# Altium schematic sheet RMII_Ethernet.SchDoc: Thermostat 8CH
size 420 x 297 mm; Author: G.Kasprowicz; CompanyName: WUT ISE; DrawnBy: G.Kasprowicz; Organization: WUT ISE; Address1: PW ISE; Address2: Nowowiejska 15/19 00-665 Warsaw; Address3: gkasprow@gmail.com; DocumentNumber: 8; Revision: 1.0; SheetNumber: 8; SheetTotal: 9; ModifiedBy: -; CheckedDate: -; Title2: Ethernet; DivGrp: WUT ISE; Designer: G.Kasprowicz; ModifiedDate: -; ProjectName: Sensor Box
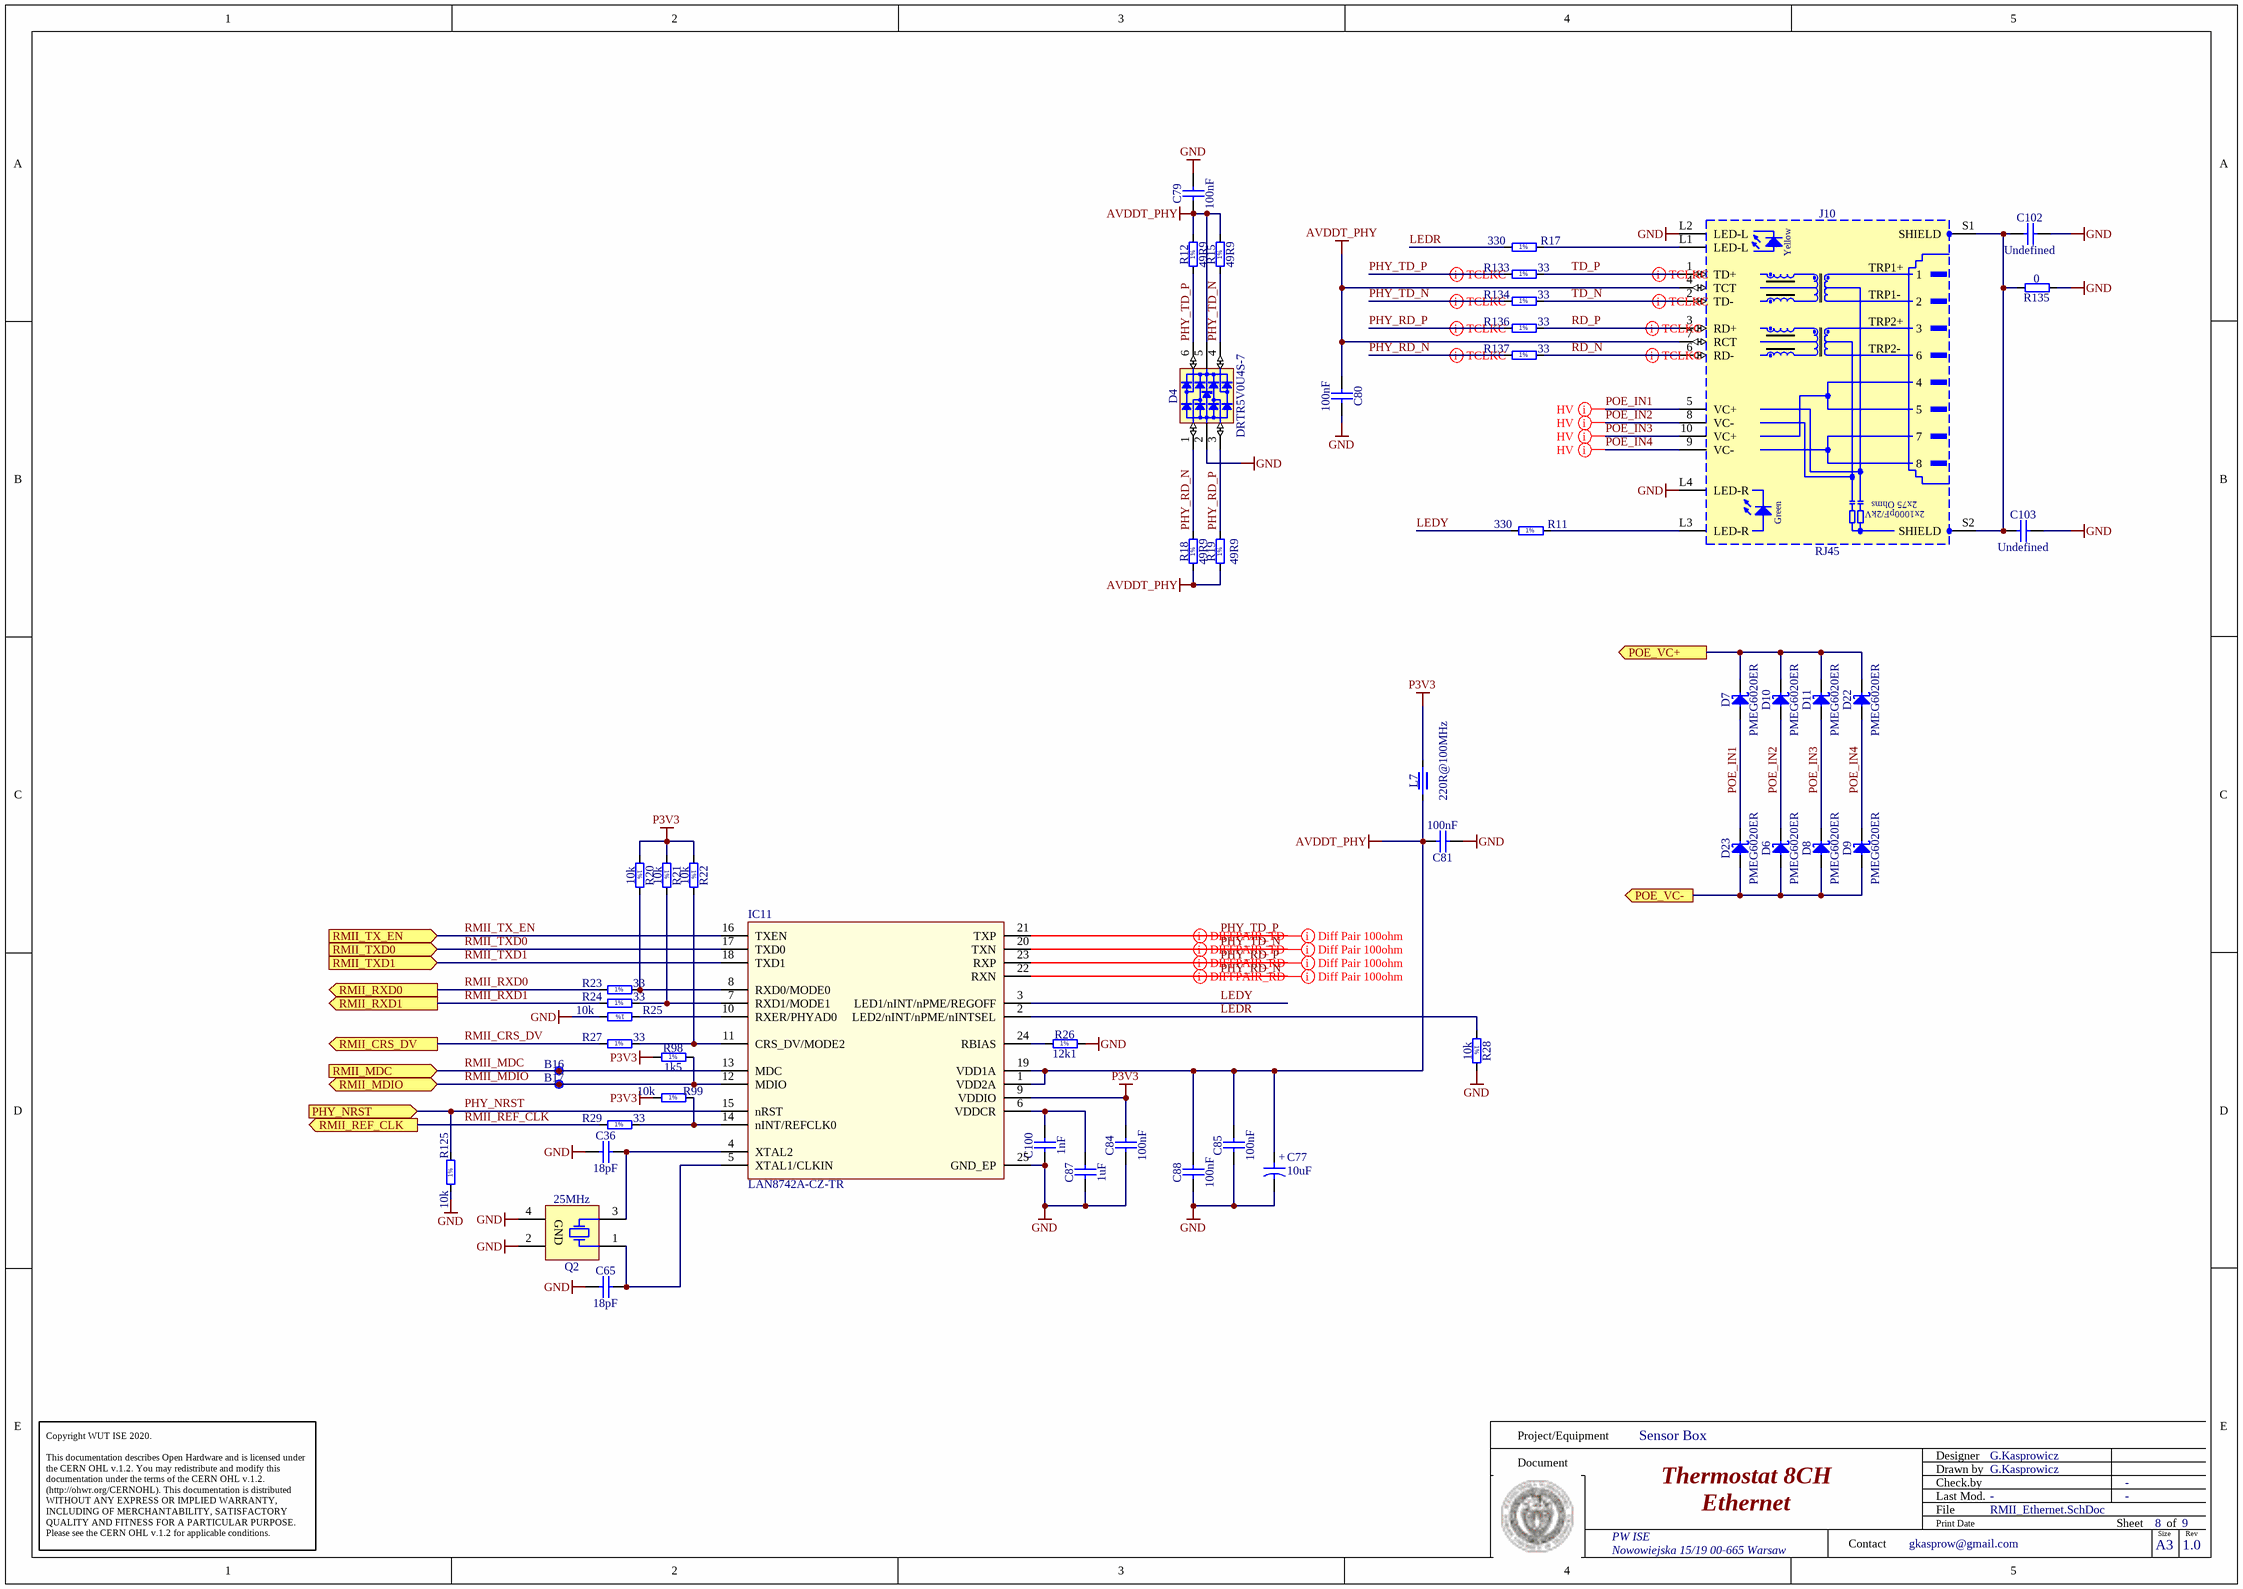
[diagram p0: RMII_Ethernet.SchDoc]

## Parts
B16  SMD Pad  [C100]  (value not drawn)
B17  SMD Pad  [C100]  (value not drawn)
C36  18pF  [CAPC1005X55N]
C65  18pF  [CAPC1005X55N]
C77  10uF  [CAPMP3216X180N]
C79  100nF  [CAPC1005X55N]
C80  100nF  [CAPC1005X55N]
C81  100nF  [CAPC1005X55N]
C84  100nF  [CAPC1005X55N]
C85  100nF  [CAPC1005X55N]
C87  1uF  [CAPC1608X87N]
C88  100nF  [CAPC1005X55N]
C100  1nF  [CAPC1005X55N]
C102  Undefined  [CAPC2012X135N]
C103  Undefined  [CAPC2012X135N]
D4  DRTR5V0U4S-7  [SOT65P210X110-6N]
D6  PMEG6020ER  [SODFL3517X110N]
D7  PMEG6020ER  [SODFL3517X110N]
D8  PMEG6020ER  [SODFL3517X110N]
D9  PMEG6020ER  [SODFL3517X110N]
D10  PMEG6020ER  [SODFL3517X110N]
D11  PMEG6020ER  [SODFL3517X110N]
D22  PMEG6020ER  [SODFL3517X110N]
D23  PMEG6020ER  [SODFL3517X110N]
IC11  LAN8742A-CZ-TR  [QFN24_0R5_4X4]
J10  RJ45  [ABRACON_ARJM11C7-114-BA-EW2]
L7  220R@100MHz  [INDC1005X55N]
Q2  25MHz  [XTAL_EPSON_TSX-3225]
R11  330  [RESC1005X40N]
R12  49R9  [RESC1005X40N]
R15  49R9  [RESC1005X40N]
R17  330  [RESC1005X40N]
R18  49R9  [RESC1005X40N]
R19  49R9  [RESC1005X40N]
R20  10k  [RESC1005X40N]
R21  10k  [RESC1005X40N]
R22  10k  [RESC1005X40N]
R23  33  [RESC1005X40N]
R24  33  [RESC1005X40N]
R25  10k  [RESC1005X40N]
R26  12k1  [RESC1005X40N]
R27  33  [RESC1005X40N]
R28  10k  [RESC1005X40N]
R29  33  [RESC1005X40N]
R98  1k5  [RESC1005X40N]
R99  10k  [RESC1005X40N]
R125  10k  [RESC1005X40N]
R133  33  [RESC1005X40N]
R134  33  [RESC1005X40N]
R135  0  [RESC1608X55N]
R136  33  [RESC1005X40N]
R137  33  [RESC1005X40N]

## Ports
PHY_NRST (in), POE_VC+ (out), POE_VC- (out), RMII_CRS_DV (out), RMII_MDC (in), RMII_MDIO (bidir), RMII_REF_CLK (out), RMII_RXD0 (out), RMII_RXD1 (out), RMII_TX_EN (in), RMII_TXD0 (in), RMII_TXD1 (in)

## Nets
AVDDT_PHY: C77.1 C79.1 C80.2 C81.2 C85.2 C88.2 D4.5(VBUS) IC11.1(VDD2A) IC11.19(VDD1A) J10.4(TCT) J10.7(RCT) L7.1 R12.2 R15.2 R18.1 R19.1
GND: C36.1 C65.1 C77.2 C79.2 C80.1 C81.1 C84.1 C85.1 C87.1 C88.1 C100.1 C102.2 C103.2 D4.2(GND) IC11.25(GND_EP) J10.L2(LED-L) J10.L4(LED-R) Q2.2(GND) Q2.4(GND) R25.2 R26.2 R28.2 R125.1 R135.1
P3V3: C84.2 IC11.9(VDDIO) L7.2 R20.1 R21.1 R22.1 R98.1 R99.1
LEDR: IC11.2(LED2/nINT/nPME/nINTSEL) R17.1 R28.1
LEDY: IC11.3(LED1/nINT/nPME/REGOFF) R11.1
PHY_NRST: IC11.15(nRST) R125.2 ; port PHY_NRST
PHY_RD_N: D4.1(I/O1) IC11.22(RXN) R18.2 R137.1
PHY_RD_P: D4.3(I/O2) IC11.23(RXP) R19.2 R136.1
PHY_TD_N: D4.4(I/O3) IC11.20(TXN) R15.1 R134.1
PHY_TD_P: D4.6(I/O4) IC11.21(TXP) R12.1 R133.1
POE_IN1: D7.2(A) D23.1(C) J10.5(VC+)
POE_IN2: D6.1(C) D10.2(A) J10.8(VC-)
POE_IN3: D8.1(C) D11.2(A) J10.10(VC+)
POE_IN4: D9.1(C) D22.2(A) J10.9(VC-)
POE_VC+: D7.1(C) D10.1(C) D11.1(C) D22.1(C) ; port POE_VC+
POE_VC-: D6.2(A) D8.2(A) D9.2(A) D23.2(A) ; port POE_VC-
RD_N: J10.6(RD-) R137.2
RD_P: J10.3(RD+) R136.2
RMII_CRS_DV: R27.1 ; port RMII_CRS_DV
RMII_MDC: B16.1 IC11.13(MDC) ; port RMII_MDC
RMII_MDIO: B17.1 IC11.12(MDIO) R98.2 ; port RMII_MDIO
RMII_REF_CLK: R29.1 ; port RMII_REF_CLK
RMII_RXD0: R23.1 ; port RMII_RXD0
RMII_RXD1: R24.1 ; port RMII_RXD1
RMII_TX_EN: IC11.16(TXEN) ; port RMII_TX_EN
RMII_TXD0: IC11.17(TXD0) ; port RMII_TXD0
RMII_TXD1: IC11.18(TXD1) ; port RMII_TXD1
TD_N: J10.2(TD-) R134.2
TD_P: J10.1(TD+) R133.2
NetC36_2: C36.2 IC11.4(XTAL2) Q2.3(X)
NetC65_2: C65.2 IC11.5(XTAL1/CLKIN) Q2.1(X)
NetC87_2: C87.2 C100.2 IC11.6(VDDCR)
NetC102_1: C102.1 C103.1 J10.S1(SHIELD) J10.S2(SHIELD) R135.2
NetIC11_7: IC11.7(RXD1/MODE1) R21.2 R24.2
NetIC11_8: IC11.8(RXD0/MODE0) R20.2 R23.2
NetIC11_10: IC11.10(RXER/PHYAD0) R25.1
NetIC11_11: IC11.11(CRS_DV/MODE2) R22.2 R27.2
NetIC11_14: IC11.14(nINT/REFCLK0) R29.2 R99.2
NetIC11_24: IC11.24(RBIAS) R26.1
NetJ10_L1: J10.L1(LED-L) R17.2
NetJ10_L3: J10.L3(LED-R) R11.2

## Layout directives
differential pair: PHY_RD_N, PHY_RD_P, PHY_TD_N, PHY_TD_P, RD_N, RD_P, TD_N, TD_P
rule Matched Net Lengths [Tolerance = 100mil]: PHY_RD_N, PHY_RD_P, PHY_TD_N, PHY_TD_P
net class HV: POE_IN1, POE_IN2, POE_IN3, POE_IN4

## Notes on the sheet
- Project/Equipment
- Document
- Designer
- Drawn by
- Check.by
- Copyright WUT ISE 2020.
  This documentation describes Open Hardware and is licensed under the CERN OHL v.1.2. You may redistribute and modify this documentation under the terms of the CERN OHL v.1.2. (http://ohwr.org/CERNOHL). This documentation is distributed WITHOUT ANY EXPRESS OR IMPLIED WARRANTY, INCLUDING OF MERCHANTABILITY, SATISFACTORY QUALITY AND FITNESS FOR A PARTICULAR PURPOSE. Please see the CERN OHL v.1.2 for applicable conditions.
- Contact
- File
- Last Mod.
- Print Date
- Sheet
- Size
- A3
- of
- Rev
- (in symbol CON_ETH_POE_ARJM11C7) Yellow; TRP1+; TRP1-; TRP2+; TRP2-; 2x75 Ohms; Green; 2x1000pF/2kV
- (in symbol CTE3216-18_10UF_16V_20%_AVX_TCJ) +
- (in symbol R0402_1K5_1%_0.0625W_100PPM) 1%
- (in symbol R0402_10K_1%_0.0625W_100PPM) 1%
- (in symbol R0402_12K1_1%_0.0625W_100PPM) 1%
- (in symbol R0402_33R_1%_0.0625W_100PPM) 1%
- (in symbol R0402_49R9_1%_0.0625W_100PPM) 1%
- (in symbol R0402_330R_1%_0.0625W_100PPM) 1%

## Library data of the parts
B16 B17 = SMD_PAD_D1MM: Through Hole Pad; Part Description: 1mm Diameter SMD Pad; Mounted: No; Part Number: SMD_PAD_D1MM; Component Kind: Standard (No BOM); Component Type: Standard (No BOM); Pin Count: 1; Family: SMD Pad; Socket: No; SMD: No; Sense: No; Status: None; ComponentHeight: 0mm; HelpURL: Undefined; Author: CERN DEM JLC; CreateDate: 10.10.2017; LatestRevisionDate: 10.10.2017; PackageDescription: 1mm Diameter SMD Pad
C36 C65 = CC0402_18PF_50V_5%_C0G: Non-polarised capacitor; Part Description: SMD Multilayer Chip Ceramic Capacitor; Manufacturer: GENERIC; Manufacturer1 Part Number: C0402C180J5GACTU; Voltage: 50V; TC: C0G/NP0; Tolerance: ±5%; Part Number: CC0402_18PF_50V_5%_C0G; Component Kind: Standard; Component Type: Standard; Pin Count: 2; Value: 18pF; Status: Preferred; Manufacturer Part Number: CC0402_18PF_50V_5%_C0G; Case: 0402; Mounted: Yes; Socket: No; SMD: Yes; Sense: No; Manufacturer1 Example: KEMET; Manufacturer1 ComponentHeight: 0.55mm; HelpURL: \\cern.ch\dfs\Applications\Altium\Datasheets\CC0805_C0G_KEMET_(Commercial Grade).pdf; Author: CERN DEM JLC; CreateDate: 04.10.2016; LatestRevisionDate: 04.10.2016
C77 = CTE3216-18_10UF_16V_20%_AVX_TCJ: Polarised capacitor; Part Description: ESR 0R200 Tantalum Solid Electrolytic Chip Capacitor with Conductive Polymer Electrode; Manufacturer: AVX; Manufacturer Part Number: TCJA106M016R0200; Voltage: 16V; Tolerance: ±20%; Part Number: CTE3216-18_10UF_16V_20%_AVX_TCJ; Component Kind: Standard; Component Type: Standard; Pin Count: 2; Value: 10uF; Status: Preferred; Case: A; Mounted: Yes; Socket: No; SMD: Yes; Sense: No; ComponentHeight: 1.8mm; HelpURL: \\cern.ch\dfs\Applications\Altium\Datasheets\CTE_AVX_TCJ.pdf; Author: CERN DEM JLC; CreateDate: 29.03.2012; LatestRevisionDate: 29.03.2012
C79-C81 C84 C85 C88 = CC0402_100NF_16V_10%_X5R: Non-polarised capacitor; Part Description: SMD Multilayer Chip Ceramic Capacitor; Manufacturer: GENERIC; Manufacturer1 Part Number: GRM155R61C104KA88D; Voltage: 16V; TC: X5R; Tolerance: ±10%; Part Number: CC0402_100NF_16V_10%_X5R; Component Kind: Standard; Component Type: Standard; Pin Count: 2; Value: 100nF; Status: None; Manufacturer Part Number: CC0402_100NF_16V_10%_X5R; Case: 0402; Mounted: Yes; Socket: No; SMD: Yes; Manufacturer1 Example: MURATA; Manufacturer1 ComponentHeight: 0.55mm; HelpURL: \\cern.ch\dfs\Applications\Altium\Datasheets\CC0402_X5R_MURATA_GRM.pdf; Author: CERN DEM JLC; Sense: No
  C79 C80: CreateDate: 10.12.2013; LatestRevisionDate: 10.12.2013
  C81 C84 C85 C88: CreateDate: 10/12/2013; LatestRevisionDate: 10/12/2013
C87 = CC0603_1UF_16V_10%_X7R: Non-polarised capacitor; Part Description: SMD Multilayer Chip Ceramic Capacitor; Manufacturer: GENERIC; Manufacturer1 Part Number: 223878615663; Voltage: 16V; TC: X7R; Tolerance: ±10%; Part Number: CC0603_1UF_16V_10%_X7R; Component Kind: Standard; Component Type: Standard; Pin Count: 2; Value: 1uF; Status: None; Manufacturer Part Number: CC0603_1uF_16V_10%_X7R; Case: 0603; Mounted: Yes; Socket: No; SMD: Yes; Sense: No; Manufacturer1 Example: YAGEO PHYCOMP; Manufacturer1 ComponentHeight: 0.9mm; HelpURL: \\cern.ch\dfs\Applications\Altium\Datasheets\CC0603_X7R_PHYCOMP.pdf; Author: CERN DEM JLC; CreateDate: 03/12/2007; LatestRevisionDate: 17/04/2015
C100 = CC0402_1NF_50V_10%_X7R: Non-polarised capacitor; Part Description: SMD Multilayer Chip Ceramic Capacitor; Manufacturer: GENERIC; Manufacturer1 Part Number: 223858715623; Voltage: 50V; TC: X7R; Tolerance: ±10%; Part Number: CC0402_1NF_50V_10%_X7R; Component Kind: Standard; Component Type: Standard; Pin Count: 2; Value: 1nF; Status: Not Recommended; Manufacturer Part Number: CC0402_1NF_50V_10%_X7R; Case: 0402; Mounted: Yes; Socket: No; SMD: Yes; Sense: No; Manufacturer1 Example: PHYCOMP; Manufacturer1 ComponentHeight: 0.55mm; HelpURL: \\cern.ch\dfs\Applications\Altium\Datasheets\CC0402_X7R_PHYCOMP.pdf; Author: CERN DEM JLC; CreateDate: 03/12/2007; LatestRevisionDate: 03/12/2007
C102 C103 = CC0805_NO-VALUE: Non-polarised capacitor; Part Description: Reserved Footprint For 0805(2012) Chip Ceramic Capacitor; Mounted: No; Part Number: CC0805_NO-VALUE; Component Kind: Standard; Component Type: Standard; Pin Count: 2; Value: Undefined; Status: None; Manufacturer: Undefined; Manufacturer Part Number: CC0805_NO-VALUE; Case: 0805; Socket: No; SMD: Yes; Sense: No; Manufacturer1 ComponentHeight: 1.35mm; HelpURL: Undefined; Author: CERN DEM JLC; CreateDate: 10.12.2008; LatestRevisionDate: 11.09.2013
D4 = D_TVS_DRTR5V0U4S-7: Integrated Quad Ultra-Low Capacitance ESD Protection; Part Description: Integrated Quad Ultra-Low Capacitance ESD (±8kV) Protection; Manufacturer: DIODES; PressFit: No; Bonding: No; Status Comment: Active; Part Number: DRTR5V0U4S-7; Component Kind: Standard; Component Type: Standard; Device: DRTR5V0U4S-7; PackageDescription: SOT363, SC70-6, 0.65mm Pitch; 6 Pin, 1.25mm W X 2.00mm L X 1.10mm H body, IPC Medium Density; Status: Active; Manufacturer Part Number: DRTR5V0U4S-7; Pin Count: 6; Case: SOT363; Mounted: Yes; Socket: No; SMD: Yes; Sense: No; ComponentHeight: 1.1mm; HelpURL: \\cern.ch\dfs\Applications\Altium\Datasheets\PRTR5V0U4Y.pdf; Author: GK; CreateDate: 24.01.2017; LatestRevisionDate: 14.09.2020
D6-D11 D22 D23 = PMEG6020ER: Schottky Diode; Part Description: MEGA Schottky Barrier Rectifier; Manufacturer: NXP SEMICONDUCTORS; Voltage: 60V; Power: 2A; PressFit: No; Bonding: No; Part Number: PMEG6020ER; Component Kind: Standard; Component Type: Standard; Device: PMEG6020ER; PackageDescription: SODFL Diode (SOD123W); 2.60mm W X 1.70mm L X 1.10mm H body, IPC Medium Density; Manufacturer Part Number: PMEG6020ER; Pin Count: 2; Case: SOD123; Mounted: Yes; Socket: No; SMD: Yes; Sense: No; ComponentHeight: 0.65mm; HelpURL: \\cern.ch\dfs\Applications\Altium\Datasheets\PMEG6020ER.pdf; Author: CERN DEM JMW; CreateDate: 19.06.2014; LatestRevisionDate: 19.06.2014
IC11 = IFC_LAN8742A: LAN8742A-CZ-TR - Small Footprint RMII 10/100 Ethernet, Transceiver with HP Auto-MDIX and flexPWR Technology SQFN-24; Manuf_1: MICROCHIP; Order: LAN8742A-CZ-TR; Manuf_Part_1: LAN8742A-CZ-TR; Distrib: MICROCHIP
J10 = CON_ETH_POE_ARJM11C7: MagJack 10/100BaseT, PoE+, 1X1, OG/Y, -40 to 85*C, Tab Up, RoHS; Part Number: 5-2337992-3; Part Description: 1 Port, Orange Green/Yellow LEDs, RJ45 10/100BaseT, PoE, Ethernet MagJack® Connector Module; Manufacturer: TE; PressFit: No; Component Kind: Standard; Component Type: Standard; Pin Count: 18; Family: RJ45; Mounted: Yes; Socket: No; SMD: No; Sense: No; Status: None; Manufacturer Part Number: 5-2337992-3; ComponentHeight: 13.61mm; HelpURL: \\cern.ch\dfs\Applications\Altium\Datasheets\BELFUSE_0826-1X1T-GJ-F.pdf; Author: GK; CreateDate: 05.11.2012; LatestRevisionDate: 05.11.2012
L7 = IND0402_MURATA_BLM15HB221SN1: Part Description: SMD EMIFIL Suppression Chip Ferrite Bead; Manufacturer: MURATA; Power: 250mA; Resistance: 1R; Tolerance: ±25%; Part Number: IND0402_MURATA_BLM15HB221SN1; Component Kind: Standard; Component Type: Standard; Pin Count: 2; Value: 220R@100MHz; Status: None; Manufacturer Part Number: BLM15HB221SN1; Case: 0402; Mounted: Yes; Socket: No; SMD: Yes; Sense: No; ComponentHeight: 0.55mm; HelpURL: \\cern.ch\dfs\Applications\Altium\Datasheets\IND0402_MURATA_BLM15H.pdf; Author: CERN DEM JLC; CreateDate: 23.06.2009; LatestRevisionDate: 25.10.2018
Q2 = XTAL_25MHZ_EPSON_TSX-3225 25.0000MF10Z-AC: Crystal 4 pins 1=XTAL Control 2=GND3=XTAL 4=GND; Part Description: Tolerance ±10 ppm,  Stability:± 10ppm, -20°C to 75°C, 9pF, Surface Mount Quartz Crystal, TX-3225 Series; Manufacturer: EPSON; PressFit: No; Bonding: No; Part Number: XTAL_25MHZ_EPSON_TSX-3225 25.0000MF10Z-AC; Component Kind: Standard; Component Type: Standard; PackageDescription: Crystal TSX-3225 Serie, Corner Concave; 4 pin, 2.50mm L X 3.2mm W X 0.6mm H; Value: 25MHz; Manufacturer Part Number: TSX-3225 25.0000MF10Z-AC; Pin Count: 4; Mounted: Yes; Socket: No; SMD: Yes; Sense: No; ComponentHeight: 0.6mm; HelpURL: \\cern.ch\dfs\Applications\Altium\Datasheets\XTAL_EPSON_TSX-3225.pdf; ComponentLink1URL: \\cern.ch\dfs\Applications\Altium\Datasheets\XTAL_EPSON_TSX-3225_Ordering-Informations.pdf; ComponentLink1Description: Ordering Informations; Author: CERN DEM JLC; CreateDate: 03.04.2012; LatestRevisionDate: 06.10.2016
R11 R17 = R0402_330R_1%_0.0625W_100PPM: Resistor - 1%; Part Description: General Purpose Thick Film Chip Resistor; Manufacturer: GENERIC; Manufacturer1 Part Number: 232270673301L; TC: ±100ppm/°C; PressFit: No; Part Number: R0402_330R_1%_0.0625W_100PPM; Component Kind: Standard; Component Type: Standard; Pin Count: 2; Value: 330; Status: Not Recommended; Power: 0.0625W; Tolerance: ±1%; Manufacturer Part Number: R0402_330R_1%_0.0625W_100PPM; Case: 0402; Mounted: Yes; Sense: No; Socket: No; SMD: Yes; Manufacturer1 Example: YAGEO PHYCOMP; Manufacturer1 ComponentHeight: 0.4mm; HelpURL: \\cern.ch\dfs\Applications\Altium\Datasheets\R0402_Phycomp_RC0402.pdf; Author: CERN DEM JLC; CreateDate: 03.12.2007; LatestRevisionDate: 17.10.2012
R12 R15 R18 R19 = R0402_49R9_1%_0.0625W_100PPM: Resistor - 1%; Part Description: General Purpose Thick Film Chip Resistor; Manufacturer: GENERIC; Manufacturer1 Part Number: 232270674999L or RC0402FR-0749R9L; TC: ±100ppm/°C; Table: Resistors SMD; Part Number: R0402_49R9_1%_0.0625W_100PPM; Component Kind: Standard; Component Type: Standard; Pin Count: 2; Value: 49R9; Status: Not recommended; Power: 0.0625W; Tolerance: ±1%; Manufacturer Part Number: R0402_49R9_1%_0.0625W_100PPM; Case: 0402; Mounted: Yes; Socket: No; SMD: Yes; Manufacturer1 Example: YAGEO PHYCOMP; Manufacturer1 ComponentHeight: 0.4mm; HelpURL: \\cern.ch\dfs\Applications\Altium\Datasheets\R0402_Phycomp_RC0402.pdf; Author: CERN DEM JLC; CreateDate: 2012-10-24; LatestRevisionDate: 2012-10-24
R20-R22 R25 R28 R99 R125 = R0402_10K_1%_0.0625W_100PPM: Resistor - 1%; Part Description: General Purpose Thick Film Chip Resistor; Manufacturer: GENERIC; Manufacturer1 Part Number: 232270671003L; TC: ±100ppm/°C; PressFit: No; Value: 10k; Part Number: R0402_10K_1%_0.0625W_100PPM; Component Kind: Standard; Component Type: Standard; Pin Count: 2; Status: Not Recommended; Power: 0.0625W; Tolerance: ±1%; Manufacturer Part Number: R0402_10K_1%_0.0625W_100PPM; Case: 0402; Mounted: Yes; Sense: No; Socket: No; SMD: Yes; Manufacturer1 Example: YAGEO PHYCOMP; Manufacturer1 ComponentHeight: 0.4mm; HelpURL: \\cern.ch\dfs\Applications\Altium\Datasheets\R0402_Phycomp_RC0402.pdf; Author: CERN DEM JLC; CreateDate: 03/12/2007; LatestRevisionDate: 17/10/2012
R23 R24 R27 R29 R133 R134 R136 R137 = R0402_33R_1%_0.0625W_100PPM: Resistor - 1%; Part Description: General Purpose Thick Film Chip Resistor; Manufacturer: GENERIC; Manufacturer1 Part Number: 232270673309L; TC: ±100ppm/°C; PressFit: No; Part Number: R0402_33R_1%_0.0625W_100PPM; Component Kind: Standard; Component Type: Standard; Pin Count: 2; Value: 33; Status: Not Recommended; Power: 0.0625W; Tolerance: ±1%; Manufacturer Part Number: R0402_33R_1%_0.0625W_100PPM; Case: 0402; Mounted: Yes; Sense: No; Socket: No; SMD: Yes; Manufacturer1 Example: YAGEO PHYCOMP; Manufacturer1 ComponentHeight: 0.4mm; HelpURL: \\cern.ch\dfs\Applications\Altium\Datasheets\R0402_Phycomp_RC0402.pdf; Author: CERN DEM JLC; CreateDate: 03/12/2007; LatestRevisionDate: 17/10/2012
R26 = R0402_12K1_1%_0.0625W_100PPM: Resistor - 1%; Part Description: General Purpose Thick Film Chip Resistor; Manufacturer: GENERIC; Manufacturer1 Part Number: 232270671213L or RC0402FR-0712K1L; TC: ±100ppm/°C; PressFit: No; Part Number: R0402_12K1_1%_0.0625W_100PPM; Component Kind: Standard; Component Type: Standard; Pin Count: 2; Value: 12k1; Status: Not Recommended; Power: 0.0625W; Tolerance: ±1%; Manufacturer Part Number: R0402_12K1_1%_0.0625W_100PPM; Case: 0402; Mounted: Yes; Sense: No; Socket: No; SMD: Yes; Manufacturer1 Example: YAGEO PHYCOMP; Manufacturer1 ComponentHeight: 0.4mm; HelpURL: \\cern.ch\dfs\Applications\Altium\Datasheets\R0402_Phycomp_RC0402.pdf; Author: CERN DEM JLC; CreateDate: 24/10/2012; LatestRevisionDate: 24/10/2012
R98 = R0402_1K5_1%_0.0625W_100PPM: Resistor - 1%; Part Description: General Purpose Thick Film Chip Resistor; Manufacturer: GENERIC; Manufacturer1 Part Number: 232270671502L; TC: ±100ppm/°C; PressFit: No; Part Number: R0402_1K5_1%_0.0625W_100PPM; Component Kind: Standard; Component Type: Standard; Pin Count: 2; Value: 1k5; Status: Not Recommended; Power: 0.0625W; Tolerance: ±1%; Manufacturer Part Number: R0402_1K5_1%_0.0625W_100PPM; Case: 0402; Mounted: Yes; Sense: No; Socket: No; SMD: Yes; Manufacturer1 Example: YAGEO PHYCOMP; Manufacturer1 ComponentHeight: 0.4mm; HelpURL: \\cern.ch\dfs\Applications\Altium\Datasheets\R0402_Phycomp_RC0402.pdf; Author: CERN DEM JLC; CreateDate: 03/12/2007; LatestRevisionDate: 17/10/2012
R135 = R0603_0R_JUMPER: Resistor; Part Description: 1A (0.05R Max DC Resistance) Zero Ohm Jumper; Manufacturer: GENERIC; Manufacturer1 Part Number: NRC06Z0; PressFit: No; Part Number: R0603_0R_JUMPER; Component Kind: Standard; Component Type: Standard; Pin Count: 2; Value: 0; Status: Preferred; Manufacturer Part Number: R0603_0R_JUMPER; Case: 0603; Mounted: Yes; Sense: No; Socket: No; SMD: Yes; Manufacturer1 Example: NIC COMPONENT; Manufacturer1 ComponentHeight: 0.55mm; HelpURL: \\cern.ch\dfs\Applications\Altium\Datasheets\R0603_NIC_NRC.pdf; Author: CERN DEM JLC; CreateDate: 03.12.2007; LatestRevisionDate: 13.03.2008